# EAGLE design LED Flasher (EAGLE 9.6.2)
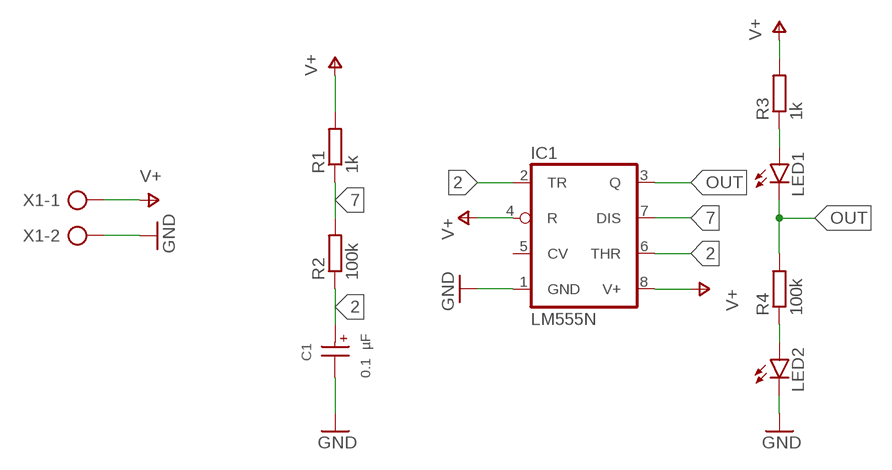
[diagram p0: schematic, sheet 1]

## Parts
C1  0.1 µF  WCAP-ATG8_5X11_860010772001  [WCAP-ATG8_5X11(DXL)]
IC1  LM555N  [DIL08]
LED1  LED3MM  [LED3MM]
LED2  LED3MM  [LED3MM]
R1  1k  R-EU_0204/7  [0204/7]
R2  100k  R-EU_0204/7  [0204/7]
R3  1k  R-EU_0204/7  [0204/7]
R4  100k  R-EU_0204/7  [0204/7]
X1  AK300/2  [AK300/2]

## Nets
2: C1.1(+) IC1.2(TR) IC1.6(THR) R2.1
7: IC1.7(DIS) R1.1 R2.2
GND: C1.2(-) IC1.1(GND) LED2.K(C) X1.2
N$1: LED1.A R3.1
N$3: LED2.A R4.1
OUT: IC1.3(Q) LED1.K(C) R4.2
V+: IC1.4(R) IC1.8(V+) R1.2 R3.2 X1.1
Unconnected: IC1.5(CV)

## Library data of the parts
C1 = Aluminium Electrolyt Capacitors:WCAP-ATG8_5X11: WCAP-ATG8 Aluminium Electrolytic Capacitors General Purpose +85 °C Characteristics General purpose product series with max. operating temperature of +85 °C Wide range of capacitance value Mounting style: THT Radial Capacitance range: 0.1 µF ‒ 33000 µF Capacitance tolerance: ±20 % Voltage range (UR): 10 ‒ 400 V(DC) Operating temperature: -40 °C up to +85 °C for UR < 400 V(DC) -25 °C up to +85 °C for UR ≥ 400 V(DC) Endurance: 2000 h @ +85 °C Dimensions (DxL) in mm: 5.0 x 11.0 up to 22.0 x 51.0 Recommended soldering: Wave soldering Applications Filtering Smoothing Energy storage Coupling <https://www.we-online.com/catalog/media/o35732v209%20WCAP-ATG8_4C.jpg> Details see: https://www.we-online.com/catalog/en/WCAP-ATG8/ Updated by yingchun,Shan;2020-02-27 2020(C) Würth Elektronik; DATASHEET-URL: https://www.we-online.com/catalog/datasheet/860010772001.pdf; DF: 9%; DIAMETER: 5mm; I-LEAK: 3uA; I-RIPPLE: 4mA; L: 11mm; OPERATING-TEMPERATURE: -40 °C up to +85 °C; PART-NUMBER: 860010772001; PITCH: 2mm; TECHNICAL-REFERENCE: ATBC110R10M063DSPA3B000; VR: 63V(DC)
IC1 = linear:*555: TIMER
LED1 LED2 = led:LED: LED OSRAM: - CHIPLED LG R971, LG N971, LY N971, LG Q971, LY Q971, LO R971, LY R971 LH N974, LH R974 LS Q976, LO Q976, LY Q976 LO Q996 - Hyper CHIPLED LW Q18S LB Q993, LB Q99A, LB R99A - SideLED LS A670, LO A670, LY A670, LG A670, LP A670 LB A673, LV A673, LT A673, LW A673 LH A674 LY A675 LS A676, LA A676, LO A676, LY A676, LW A676 LS A679, LY A679, LG A679 - Hyper Micro SIDELED® LS Y876, LA Y876, LO Y876, LY Y876 LT Y87S - SmartLED LW L88C, LW L88S LB L89C, LB L89S, LG L890 LS L89K, LO L89K, LY L89K LS L896, LA L896, LO L896, LY L896 - TOPLED LS T670, LO T670, LY T670, LG T670, LP T670 LSG T670, LSP T670, LSY T670, LOP T670, LYG T670 LG T671, LOG T671, LSG T671 LB T673, LV T673, LT T673, LW T673 LH T674 LS T676, LA T676, LO T676, LY T676, LB T676, LH T676, LSB T676, LW T676 LB T67C, LV T67C, LT T67C, LS T67K, LO T67K, LY T67K, LW E67C LS E67B, LA E67B, LO E67B, LY E67B, LB E67C, LV E67C, LT E67C LW T67C LS T679, LY T679, LG T679 LS T770, LO T770, LY T770, LG T770, LP T770 LB T773, LV T773, LT T773, LW T773 LH T774 LS E675, LA E675, LY E675, LS T675 LS T776, LA T776, LO T776, LY T776, LB T776 LHGB T686 LT T68C, LB T68C - Hyper Mini TOPLED® LB M676 - Mini TOPLED Santana® LG M470 LS M47K, LO M47K, LY M47K Source: http://www.osram.convergy.de LUXEON: - LUMILED® LXK2-PW12-R00, LXK2-PW12-S00, LXK2-PW14-U00, LXK2-PW14-V00 LXK2-PM12-R00, LXK2-PM12-S00, LXK2-PM14-U00 LXK2-PE12-Q00, LXK2-PE12-R00, LXK2-PE12-S00, LXK2-PE14-T00, LXK2-PE14-U00 LXK2-PB12-K00, LXK2-PB12-L00, LXK2-PB12-M00, LXK2-PB14-N00, LXK2-PB14-P00, LXK2-PB14-Q00 LXK2-PR12-L00, LXK2-PR12-M00, LXK2-PR14-Q00, LXK2-PR14-R00 LXK2-PD12-Q00, LXK2-PD12-R00, LXK2-PD12-S00 LXK2-PH12-R00, LXK2-PH12-S00 LXK2-PL12-P00, LXK2-PL12-Q00, LXK2-PL12-R00 Source: www.luxeon.com KINGBRIGHT: KA-3528ASYC Source: www.kingbright.com
R1-R4 = rcl:R-EU_: RESISTOR, European symbol; SPICEPREFIX: R
X1 = con-ptr500:AK300/2: CONNECTOR; OC_FARNELL: unknown; OC_NEWARK: unknown

## Board
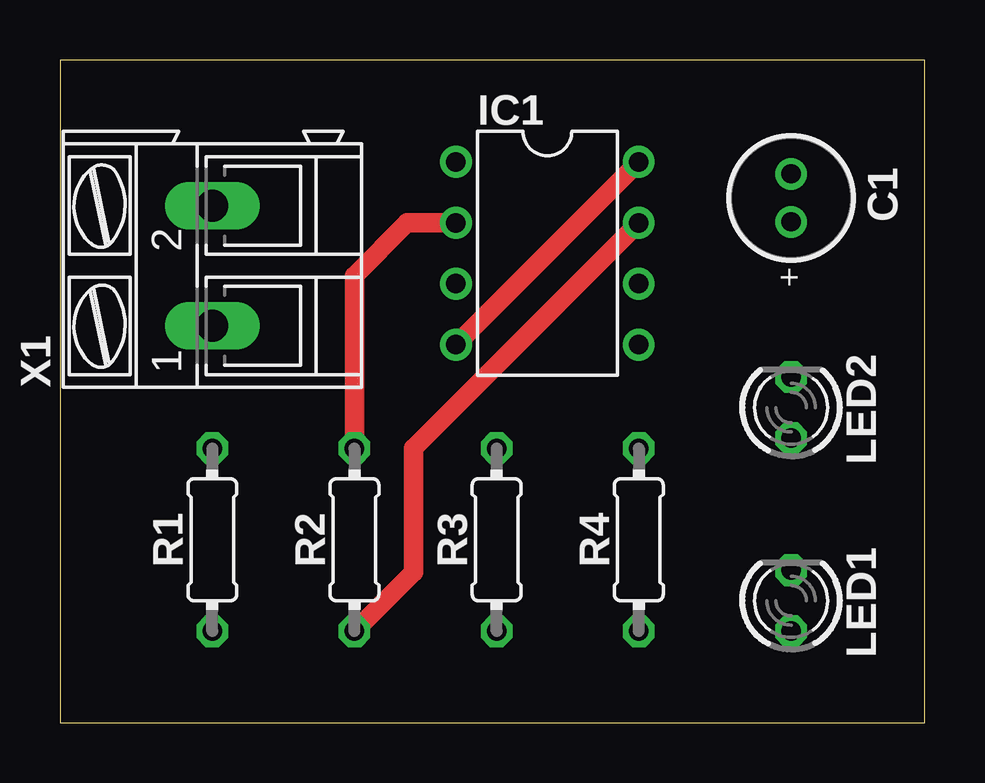
[diagram p1: board, top side]
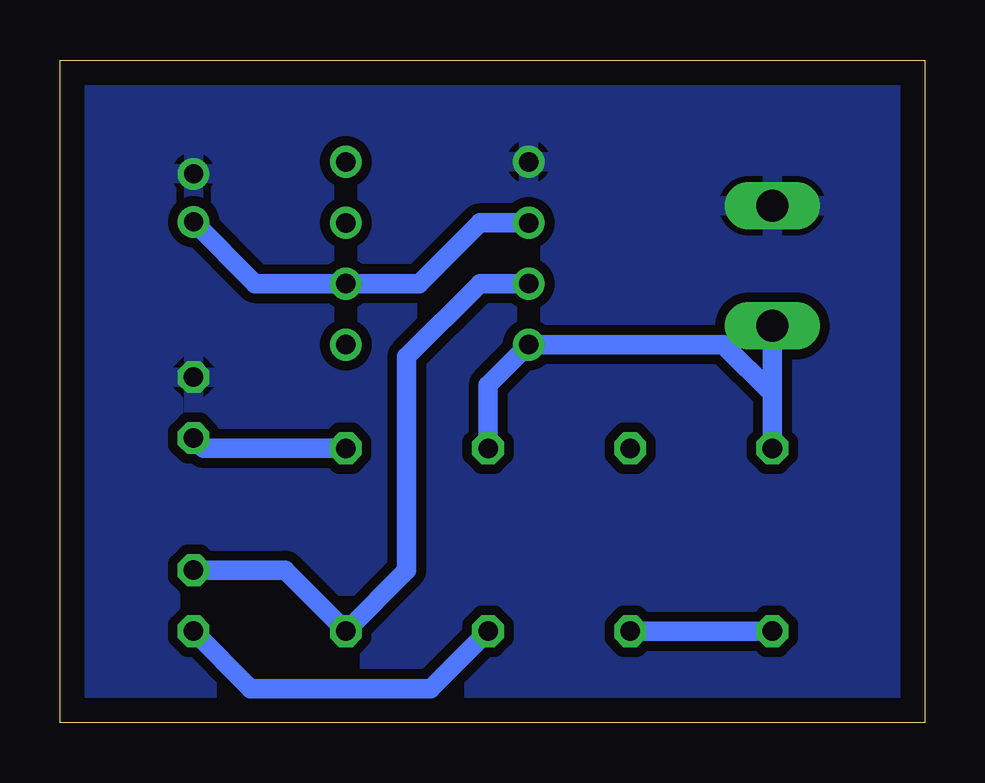
[diagram p2: board, bottom side, seen from below]

Size 36.05 x 27.61 mm. Coordinates in mm from the lower left corner, seen from the top.
Outline: 0,0 36.05,0 36.05,27.61 0,27.61 0,0
Copper layers (1*16): Top 0.035mm / dielectric 1.5mm / Bottom 0.035mm
Design rules "default *": minimum track width 32mil, minimum drill 0.35mm, track to track 16mil, track to pad 16mil, pad to pad 6mil, via to via 6mil, smd to smd 6mil, copper to edge 40mil, drill to drill 6mil, minimum pad ring 10mil, minimum via ring 8mil, stop-mask expansion 4mil, vias tented up to drill 0mil, thermal gap 10mil

### Footprints (pad centres in the part's own frame; a part is rotated, then mirrored left to right if it is on the bottom)
WCAP-ATG8_5X11(DXL) = drill 0.8: 1 1,0; 2 -1,0
DIL08 = drill 0.813 pad 1.27: 1 -3.81,-3.81; 2 -1.27,-3.81; 3 1.27,-3.81; 4 3.81,-3.81; 5 3.81,3.81; 6 1.27,3.81; 7 -1.27,3.81; 8 -3.81,3.81
LED3MM = drill 0.813 octagon: A -1.27,0; K 1.27,0
0204/7 = drill 0.813 octagon: 1 -3.81,0; 2 3.81,0
AK300/2 = drill 1.321 long: 1 -2.515,0; 2 2.489,0

### Placement (x,y rotation side)
C1  30.48,21.86 270 top
IC1  20.32,19.56 270 top
LED1  30.48,5.08 90 top
LED2  30.48,13.13 90 top
R1  6.35,7.62 90 top
R2  12.28,7.62 270 top
R3  18.2,7.62 90 top
R4  24.13,7.62 270 top
X1  6.35,19.05 90 top

### Tracks (layer width: path | path; a pad name or v marks a point on that pad's centre or on a via)
2
  Top 0.813: IC1.2 14.48,20.83 12.28,18.63 R2.1
  Bottom 0.813: C1.1 27.9,18.29 IC1.6 21.08,18.29 18.54,20.83 IC1.2
7
  Top 0.813: IC1.7 14.73,11.43 14.73,6.26 R2.2
  Bottom 0.813: R2.2 R1.1
GND
  pour Bottom: -1.27,30.48 40.64,30.48 40.64,-1.27 -1.27,-1.27
N$1
  Bottom 0.813: R3.1 20.59,1.42 28.09,1.42 LED1.A
N$3
  Bottom 0.813: LED2.A 30.05,11.43 R4.1
OUT
  Bottom 0.813: IC1.3 18.54,18.29 21.59,15.24 21.59,6.35 R4.2 | LED1.K 26.67,6.35 R4.2 | R4.2
V+
  Top 0.813: IC1.4 IC1.8
  Bottom 0.813: X1.1 6.35,13.72 | 6.35,13.72 R1.2 | R3.2 18.2,14.05 IC1.4 10.92,15.75 8.38,15.75 6.35,13.72